# Altium project acionadorIncendio.PrjPcb
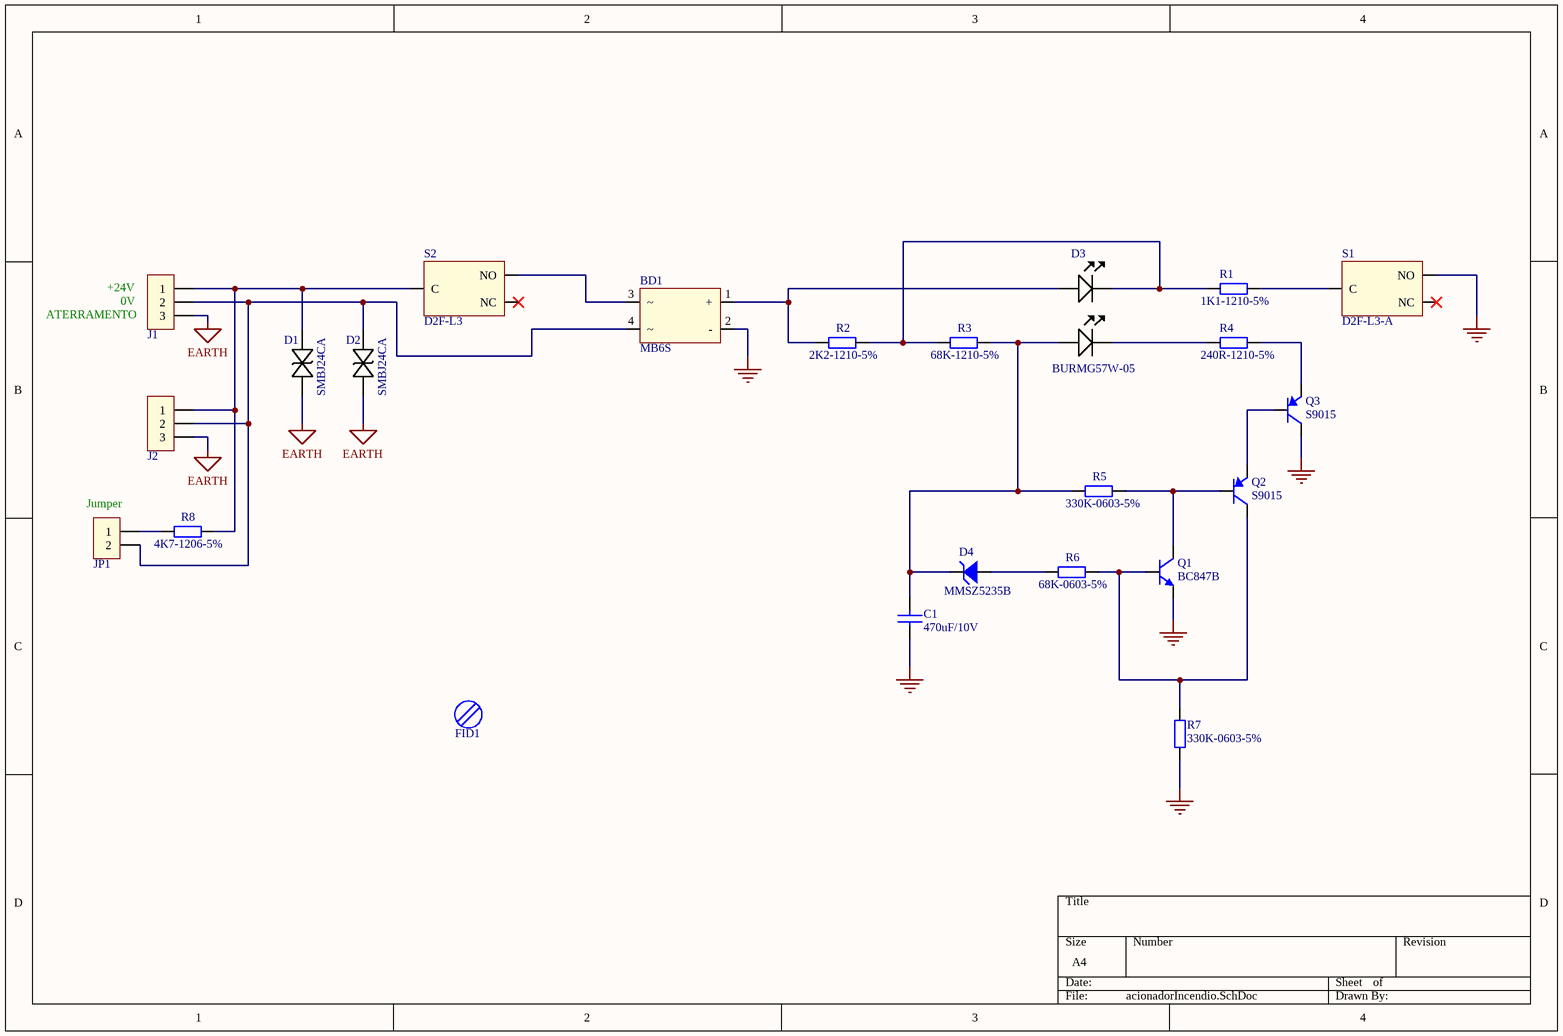
[diagram p0: acionadorIncendio.SchDoc]
1 sheet, 23 parts. Net scope: global (net labels, ports and power ports of the same name join across sheets).
Board files: acionadorIncendio.PcbDoc, painel Acionador de Incendio.PcbDoc

## Sheet acionadorIncendio.SchDoc
size A4

### Parts
BD1  MB6S  [DIO-BG-SMD_4P-L4.7-W4.0-P2.50-LS7.0-TL]
C1  470uF/10V  [CAP-SMD_BD10.0-L10.3-W10.3-LS11.3-FD]
D1  SMBJ24CA  [SMBJ50CA]
D2  SMBJ24CA  [SMBJ50CA]
D3  BURMG57W-05  [BURMG57W]
D4  MMSZ5235B  [SOD-123-2]
FID1  MEC_FIDUCIAL_1  [Fiducial_1]  (value not drawn)
J1  BORNE  [BORNE3]  (value not drawn)
J2  BORNE  [BORNE3]  (value not drawn)
JP1  JUMPER  [HEADER1X2]  (value not drawn)
Q1  BC847B  [SOT-23]
Q2  S9015  [SOT-23]
Q3  S9015  [SOT-23]
R1  1K1-1210-5%  [1210-RES]
R2  2K2-1210-5%  [1210-RES]
R3  68K-1210-5%  [1210-RES]
R4  240R-1210-5%  [1210-RES]
R5  330K-0603-5%  [0603-RES]
R6  68K-0603-5%  [0603-RES]
R7  330K-0603-5%  [0603-RES]
R8  4K7-1206-5%  [1206-RES]
S1  D2F-L3-A  [D2F-L3-A]
S2  D2F-L3  [D2F-L3]

### Nets
EARTH: D1.2 D2.2 J1.3 J2.3
GND: BD1.2(-) C1.2 Q1.2(E) Q3.2(E) R7.1 S1.2(NO)
NetBD1_1: BD1.1(+) D3.1 R2.1
NetBD1_3: BD1.3 S2.2(NO)
NetBD1_4: BD1.4 D2.1 J1.2 J2.2 JP1.2
NetC1_1: C1.1 D3.3 D4.1(K) R3.2 R5.1
NetD1_1: D1.1 J1.1 J2.1 R8.2 S2.1(C)
NetD3_2: D3.2 R1.1 R2.2 R3.1
NetD3_4: D3.4 R4.1
NetD4_2: D4.2(A) R6.1
NetJP1_1: JP1.1 R8.1
NetQ1_1: Q1.1 Q2.2(E) R6.2 R7.2
NetQ1_3: Q1.3(C) Q2.1 R5.2
NetQ2_3: Q2.3(C) Q3.1
NetQ3_3: Q3.3(C) R4.2
NetR1_2: R1.2 S1.1(C)

Not connected (* = marked no-connect by the designer): S1 3(NC)*; S2 3(NC)*

### Notes on the sheet
- (near J1) +24V
- (near J1) 0V
- ATERRAMENTO
- (near JP1) Jumper

### Library data of the parts
BD1 = MB6S: PONTE RETIFICADORA MB6S
C1 = CAP470UF: CAPACITOR ELETROLITICO 470UF 10V SMD
D3 = BURMG57W-05: LED BURMG57W-05
D4 = MMSZ5235B: DIODO ZENER MMSZ5235B
FID1 = FIDUCIAL: Código Rossi: NC
J1 J2 = BORNE3: BORNE 3 VIAS
JP1 = HEADER_1X2: BARRA PINOS 2 PINOS 180 P-2.5MM / CAPA MINI JUMPER MKBL 020B; Code: 554 / 515; Descrição: BARRA PINOS 2 PINOS 180 P-2.5MM / CAPA MINI JUMPER MKBL 020B
Q1 = BC847B: TRANSISTOR BC847B SOT-23-3 SMD
Q2 Q3 = S9015: TRANSISTOR PNP S9015 SOT23-3 SMD
R1 = RES1K1_1210: RESISTOR 1K1 1210 5%
R2 = RES2K2_1210: RESISTOR 2K2 1210 5%
R3 = RES68K_1210: RESISTOR 68K 1210 5%
R4 = RES240R_1210: RESISTOR 240R 1210 5%
R5 R7 = RES330K_0603: RESISTOR 330K 0603 5%
R6 = RES68K_0603: RESISTOR 68K 0603 5%
R8 = RES4K7_1206: RESISTOR 4K7 1206 5%
S1 = D2F-L3-A: CHAVE INTERRUPTOR D2F-L3-A
S2 = D2F-L3: CHAVE INTERRUPTOR D2F-L3